# EAGLE design Auction_Single_RevB_Final (EAGLE 7.4.0)
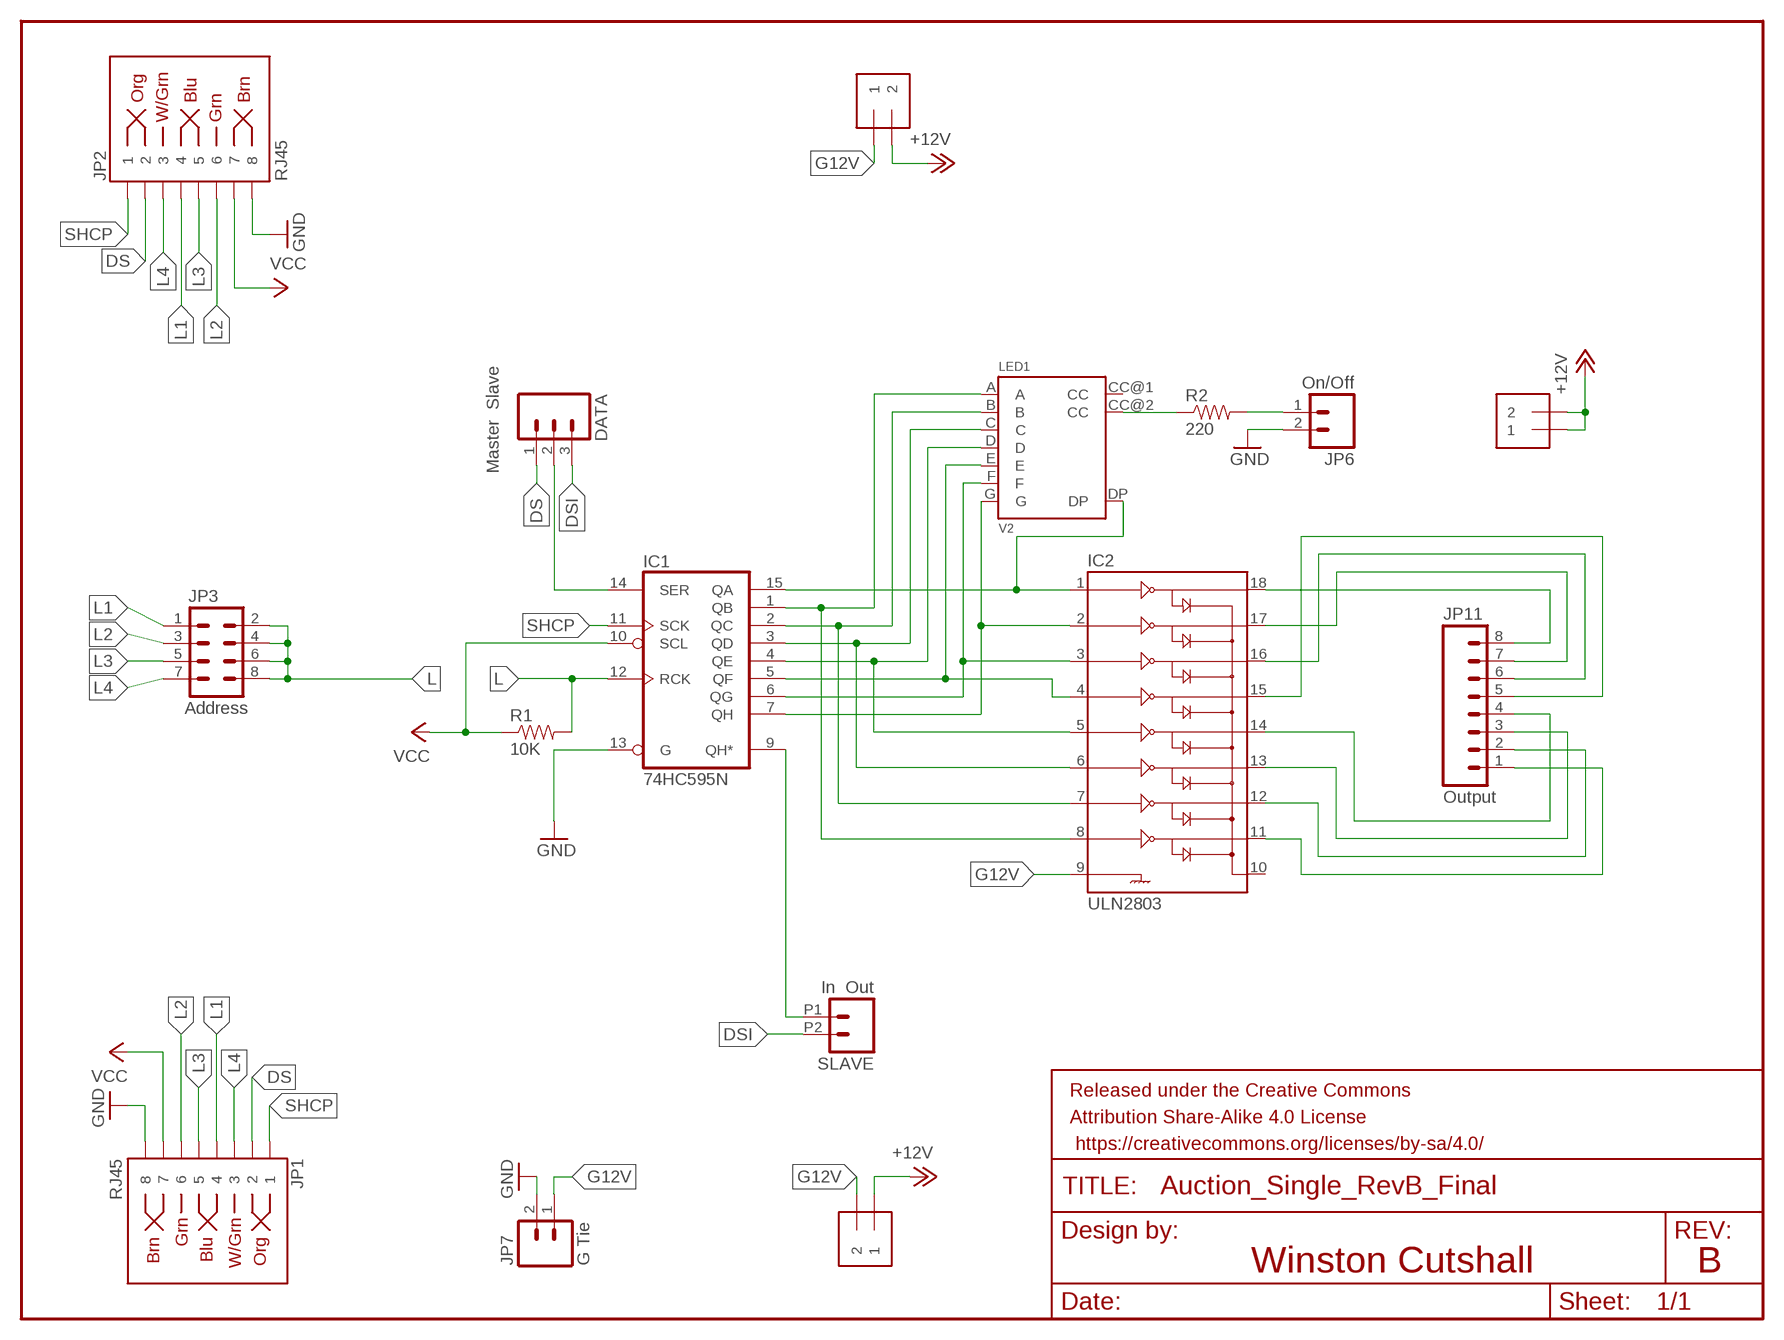
[diagram p0: schematic, sheet 1]

## Parts
DATA  Master Slave  M03PTH  [1X03]
FRAME1  FRAME-LETTER  [CREATIVE_COMMONS]
IC1  74HC595N  [DIL16]
IC2  ULN2803  ULN2803DIP  [DIL18]
JP1  RJ45  RJ45-8PTH  [RJ45-8]
JP2  RJ45  RJ45-8PTH  [RJ45-8]
JP3  Address  M04X2  [2X4]
JP6  On/Off  M02PTH  [1X02]
JP7  G Tie  M02PTH  [1X02]
JP8  1X2-3.5MM  [1X2-3.5MM]
JP9  1X2-3.5MM  [1X2-3.5MM]
JP10  1X2-3.5MM  [1X2-3.5MM]
JP11  Output  M083.5MM-8  [SCREWTERMINAL-3.5MM-8]
LED1  V2  HDSP-C3X3  [HDSP-C3X3]
R1  10K  RESISTOREZ  [AXIAL-0.3EZ]
R2  220  RESISTOREZ  [AXIAL-0.3EZ]
SLAVE  In Out  M022.54MM_SCREWTERM  [1X02_2.54_SCREWTERM]

## Nets
+12V [High Current]: JP8.1 JP9.2 JP10.1 JP10.2
A: IC1.1(QB) IC2.8 LED1.A
AA [High Current]: IC2.11 JP11.1
B: IC1.2(QC) IC2.7 LED1.B
BB [High Current]: IC2.12 JP11.2
C: IC1.3(QD) IC2.6 LED1.C
CC [High Current]: IC2.13 JP11.3
D: IC1.4(QE) IC2.5 LED1.D
DD [High Current]: IC2.14 JP11.4
DIP_SEG [Power]: JP6.1 R2.P$2
DP: IC1.15(QA) IC2.1 LED1.DP
DPA [High Current]: IC2.18 JP11.8
DS: DATA.1 JP1.2 JP2.2
DSF: DATA.2 IC1.14(SER)
DSI: DATA.3 SLAVE.P2
E: IC1.5(QF) IC2.4 LED1.E
EE [High Current]: IC2.15 JP11.5
F: IC1.6(QG) IC2.3 LED1.F
FF [High Current]: IC2.16 JP11.6
G: IC1.7(QH) IC2.2 LED1.G
G12V [High Current]: IC2.9 JP7.1 JP8.2 JP9.1
GG [High Current]: IC2.17 JP11.7
GND [Power]: IC1.13(G) JP1.8 JP2.8 JP6.2 JP7.2
L: IC1.12(RCK) JP3.2 JP3.4 JP3.6 JP3.8 R1.P$2
L1: JP1.4 JP2.4 JP3.1
L2: JP1.6 JP2.6 JP3.3
L3: JP1.5 JP2.5 JP3.5
L4: JP1.3 JP2.3 JP3.7
N$2 [Power]: LED1.CC@2(CC) R2.P$1
N$17: IC1.9(QH*) SLAVE.P1
SHCP: IC1.11(SCK) JP1.1 JP2.1
VCC [Power]: IC1.10(SCL) JP1.7 JP2.7 R1.P$1
Unconnected: IC2.10 LED1.CC@1(CC)

## Notes on the sheet
- Winston Cutshall | B

## Power pins joined to a net without a drawn wire
GND: IC1.8(GND)
VCC: IC1.16(VCC)

## Library data of the parts
DATA = SparkFun-Connectors:M03: Header 3 Standard 3-pin 0.1" header. Use with straight break away headers (SKU : PRT-00116), right angle break away headers (PRT-00553), swiss pins (PRT-00743), machine pins (PRT-00117), and female headers (PRT-00115). Molex polarized connector foot print use with SKU : PRT-08232 with associated crimp pins and housings.; MPN: 2211S-03G; OC_NEWARK: 08N6745
FRAME1 = SparkFun-Aesthetics:FRAME-LETTER: Schematic Frame Standard 8.5x11 US Letter frame
IC1 = 74xx-eu:74*595: 8-bit SHIFT REGISTER, output latch; MF: TEXAS INSTRUMENTS; MPN: SN74HC595N; OC_NEWARK: 60K6845
IC2 = SparkFun-PowerIC:ULN2803: Darlington Driver ULN2803 Darlington array. 500mA max per channel, 8-channel package. Spark Fun Electronics SKU : COM-00312; MF: Arrow Electronics; MPN: ULN2803A; OC_NEWARK: 89K1143
JP1 JP2 = SparkFun-Connectors:RJ45-8: RJ45 Jack Simple RJ45, 8-pin connection - connector for common Cat5, Cat5e, and Cat6 Ethernet cables. Footprint not yet proven in production. Connector sku is PRT-00643; Breakout PCB sku is BOB-00716.; MPN: 54602-908LF; OC_NEWARK: 51M7962; PROD_ID: CONN-08506
JP3 = SparkFun-Connectors:M04X2: .1" header, two rows of four.; MPN: M20-9980446; OC_NEWARK: 56K0011
JP6 JP7 = SparkFun-Connectors:M02: Standard 2-pin 0.1" header. Use with - straight break away headers ( PRT-00116) - right angle break away headers (PRT-00553) - swiss pins (PRT-00743) - machine pins (PRT-00117) - female headers (PRT-00115) Molex polarized connector foot print use with: PRT-08233 with associated crimp pins and housings. 2.54_SCREWTERM for use with PRT-10571. 3.5mm Screw Terminal footprints for PRT-08084 5mm Screw Terminal footprints for use with PRT-08432; MPN: 2211S-02G; OC_NEWARK: 08N6744
JP8-JP10 = adafruit:1X2: 3.5mm Terminal block http://www.ladyada.net/library/pcb/eaglelibrary.html; MPN: 1776275-2; OC_NEWARK: 97M9695
JP11 = SparkFun-Connectors:M08: Header 8 Standard 8-pin 0.1" header. Use with straight break away headers (SKU : PRT-00116), right angle break away headers (PRT-00553), swiss pins (PRT-00743), machine pins (PRT-00117), and female headers (PRT-00115).; MPN: 20020327-C081B01LF; OC_NEWARK: 59R8949
LED1 = Winston:HDSP-C3X3: Single Digit Seven Segment Display HDSP-C3x3 0.36” Single Digit PCB Based LED Display Avago Technologies www.avagotech.com (WC Lib)
R1 = SparkFun-Passives:RESISTOR: Resistor Basic schematic elements and footprints for 0603, 1206, and PTH resistors.; MF: FARNELL; MPN: MCF 0.25W 10K; OC_NEWARK: 38K0328
R2 = SparkFun-Passives:RESISTOR: Resistor Basic schematic elements and footprints for 0603, 1206, and PTH resistors.; MF: FARNELL; MPN: MCF 0.25W 220R; OC_NEWARK: 38K0351
SLAVE = SparkFun-Connectors:M02: Standard 2-pin 0.1" header. Use with - straight break away headers ( PRT-00116) - right angle break away headers (PRT-00553) - swiss pins (PRT-00743) - machine pins (PRT-00117) - female headers (PRT-00115) Molex polarized connector foot print use with: PRT-08233 with associated crimp pins and housings. 2.54_SCREWTERM for use with PRT-10571. 3.5mm Screw Terminal footprints for PRT-08084 5mm Screw Terminal footprints for use with PRT-08432; MF: TYCO ELECTRONICS; MPN: 282834-2; OC_NEWARK: 12H8386

## Net classes
0 Signal: width 0.305 mm, drill 0.635 mm, clearance 0.305 mm
1 Power: width 0.508 mm, drill 0.508 mm, clearance 0.508 mm
2 High Current: width 1.016 mm, drill 1.016 mm, clearance 1.016 mm

## Board
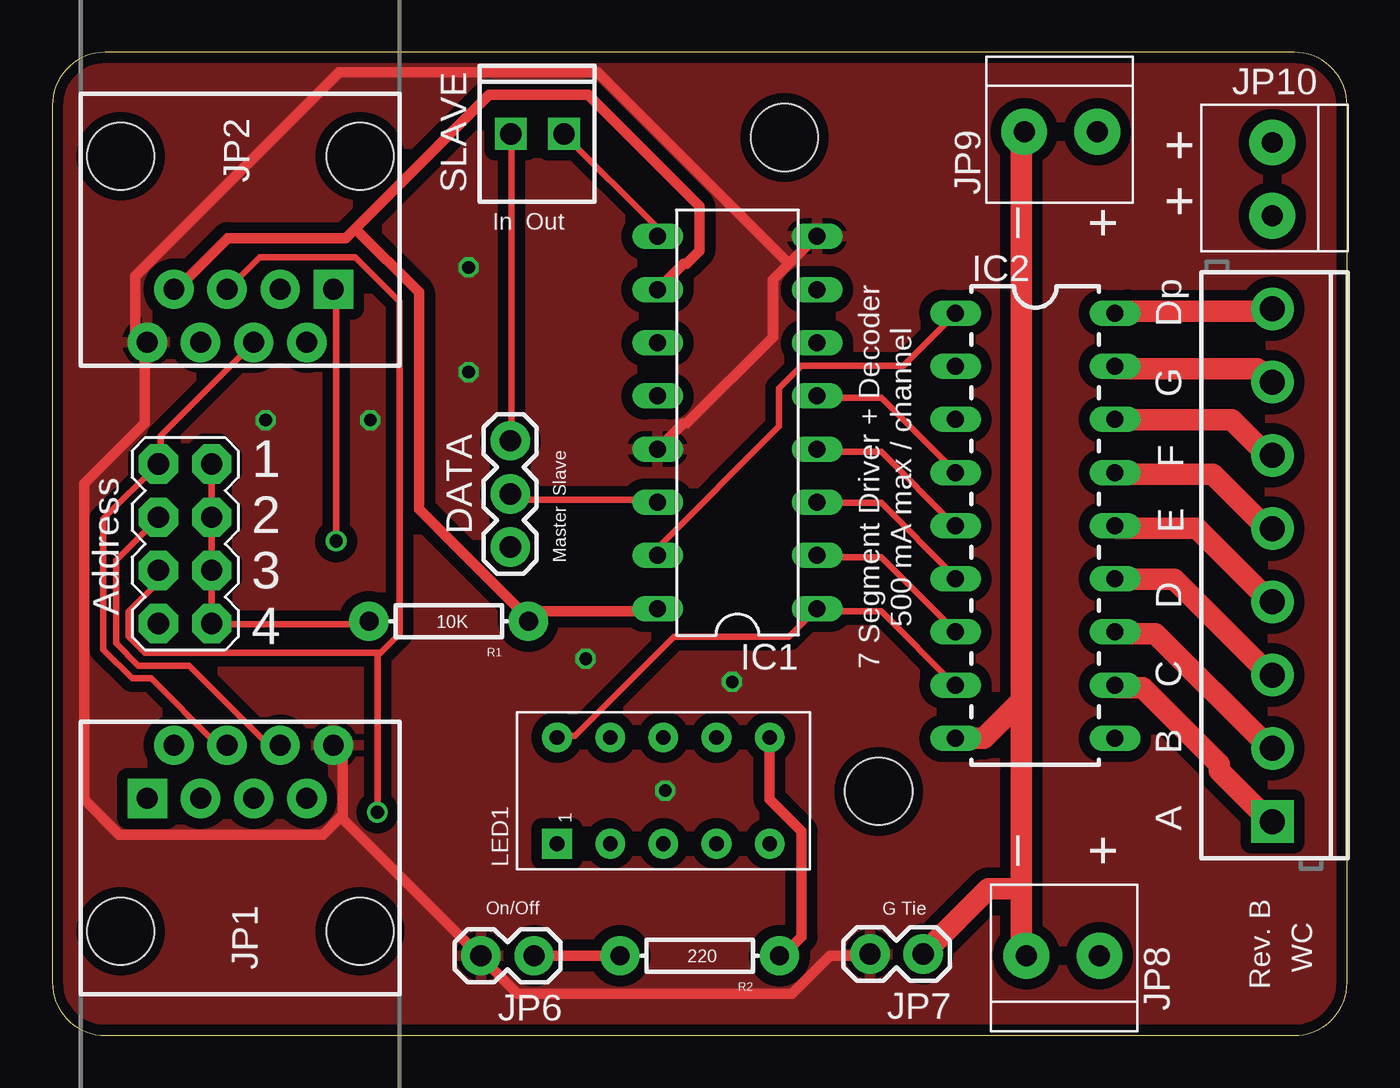
[diagram p1: board, top side]
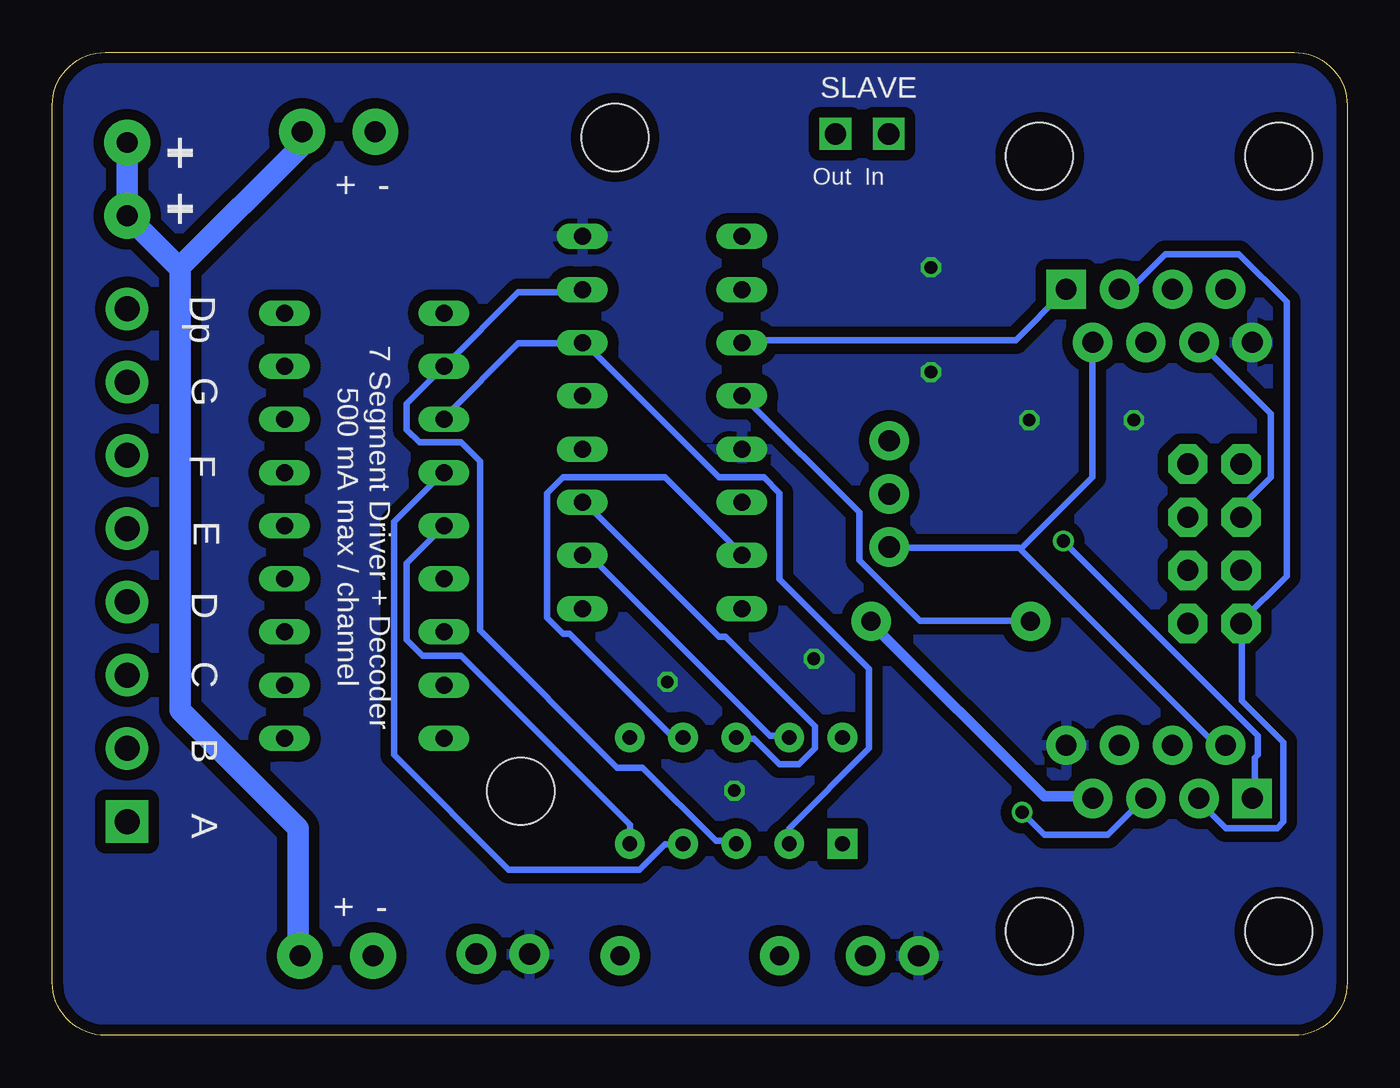
[diagram p2: board, bottom side, seen from below]

Size 61.9 x 46.98 mm. Coordinates in mm from the lower left corner, seen from the top.
Outline: 0,44.44 0,2.54 arc90 2.54,0 59.36,0 arc90 61.9,2.54 61.9,44.44 arc90 59.36,46.98 2.54,46.98 arc90 0,44.44
Copper layers (1*16): Top 0.0356mm / dielectric 1.5011mm / Bottom 0.0356mm
Design rules "LaenPCBOrder": minimum track width 6mil, minimum drill 13mil, track to track 6mil, track to pad 6mil, pad to pad 6mil, via to via 6mil, smd to smd 6mil, copper to edge 15mil, drill to drill 6mil, minimum pad ring 7mil, minimum via ring 7mil, stop-mask expansion 3mil, vias tented up to drill 0mil, thermal gap 10mil
Holes 3.2 mm at 35.01,42.91 39.51,11.66

### Footprints (pad centres in the part's own frame; a part is rotated, then mirrored left to right if it is on the bottom)
1X03 = drill 1.016 pad 1.88: 1 0,0; 2 2.54,0; 3 5.08,0
DIL16 = drill 0.813 long: 1 -8.89,-3.81; 2 -6.35,-3.81; 3 -3.81,-3.81; 4 -1.27,-3.81; 5 1.27,-3.81; 6 3.81,-3.81; 7 6.35,-3.81; 8 8.89,-3.81; 9 8.89,3.81; 10 6.35,3.81; 11 3.81,3.81; 12 1.27,3.81; 13 -1.27,3.81; 14 -3.81,3.81; 15 -6.35,3.81; 16 -8.89,3.81
DIL18 = drill 0.813 long: 1 -10.16,-3.81; 2 -7.62,-3.81; 3 -5.08,-3.81; 4 -2.54,-3.81; 5 0,-3.81; 6 2.54,-3.81; 7 5.08,-3.81; 8 7.62,-3.81; 9 10.16,-3.81; 10 10.16,3.81; 11 7.62,3.81; 12 5.08,3.81; 13 2.54,3.81; 14 0,3.81; 15 -2.54,3.81; 16 -5.08,3.81; 17 -7.62,3.81; 18 -10.16,3.81
RJ45-8 = drill 1 pad 1.88 square: 1 -4.445,6.35 | drill 1 pad 1.88: 2 -3.175,8.89; 3 -1.905,6.35; 4 -0.635,8.89; 5 0.635,6.35; 6 1.905,8.89; 7 3.175,6.35; 8 4.445,8.89 | hole 3.2: -5.715,0; 5.715,0
2X4 = drill 1.016 pad 1.88 octagon: 1 -3.81,-1.27; 2 -3.81,1.27; 3 -1.27,-1.27; 4 -1.27,1.27; 5 1.27,-1.27; 6 1.27,1.27; 7 3.81,-1.27; 8 3.81,1.27
1X02 = drill 1.016 pad 1.88: 1 0,0; 2 2.54,0
1X2-3.5MM = drill 1 pad 2.184: 1 1.8,0; 2 -1.7,0
SCREWTERMINAL-3.5MM-8 = drill 1.2 pad 2.032 square: 1 0,0 | drill 1.2 pad 2.032: 2 3.5,0; 3 7,0; 4 10.5,0; 5 14,0; 6 17.5,0; 7 21,0; 8 24.5,0
HDSP-C3X3 = drill 0.7 pad 1.422: A 2.54,5.08; B 2.54,2.54; C 2.54,0; CC@2 2.54,-5.08; D -2.54,-5.08; DP 2.54,-2.54; E -2.54,-2.54; F -2.54,2.54; G -2.54,0 | drill 0.7 pad 1.422 square: CC@1 -2.54,5.08
AXIAL-0.3EZ = drill 0.9 pad 1.88: P$1 -3.81,0; P$2 3.81,0
1X02_2.54_SCREWTERM = drill 1.016 square: P1 2.54,0; P2 0,0

### Placement (x,y rotation side)
DATA  21.89,23.34 90 top
FRAME1  15,-20 0 top  (outside the outline)
IC1  32.75,29.29 90 top
IC2  46.99,24.36 270 top
JP1  8.99,4.98 0 top
JP2  8.99,42.01 180 top
JP3  6.35,23.5 270 top
JP6  23.03,3.81 180 top
JP7  41.63,3.89 180 top
JP8  48.26,3.81 0 top
JP9  48.26,43.18 180 top
JP10  58.32,40.87 90 top
JP11  58.32,10.22 90 top
LED1  29.21,11.7 90 top
R1  18.95,19.79 180 top
R2  30.95,3.81 180 top
SLAVE  21.92,43.08 0 top

### Tracks (layer width: path | path; a pad name or v marks a point on that pad's centre or on a via)
+12V
  Bottom 1.016: 55.78,36.73 55.78,15.54 50.14,9.91 50.14,3.81 JP8.1 | JP9.2 49.96,42.55 55.78,36.73 | 55.78,36.73 55.88,36.73 JP10.2 JP10.1
A
  Top 0.305: IC2.8 43.13,16.76 39.62,20.27 36.58,20.27 IC1.1 36.42,20.27 35.2,19.05 29.72,19.05 24.99,14.33 24.23,14.33 LED1.A
AA
  Top 1.016: IC2.11 50.9,16.61 52.12,16.61 55.78,12.95 55.78,12.65 58.22,10.21 JP11.1
B
  Top 0.305: IC1.2 36.58,22.86 39.62,22.86 43.13,19.36 IC2.7
  Bottom 0.305: LED1.B 26.67,14.33 27.58,14.33 36.12,22.86 36.42,22.86 IC1.2
BB
  Top 1.016: IC2.12 50.9,19.2 52.73,19.2 58.22,13.72 JP11.2
C
  Top 0.305: IC1.3 36.58,25.45 39.62,25.45 43.13,21.95 IC2.6
  Bottom 0.305: LED1.C 29.11,14.17 28.35,14.17 27.13,12.95 26.21,12.95 25.45,13.72 25.45,14.78 29.72,19.05 30.02,19.05 36.42,25.45 IC1.3
CC
  Top 1.016: IC2.13 50.9,21.79 53.65,21.79 58.22,17.22 JP11.3
D
  Top 0.305: IC1.4 36.58,27.89 39.62,27.89 43.13,24.38 IC2.5
  Bottom 0.305: LED1.D 34.29,10.06 42.37,18.14 44.2,18.14 44.96,18.9 44.96,22.55 43.28,24.23 IC2.5
DD
  Top 1.016: IC2.14 50.9,24.23 54.71,24.23 58.22,20.73 JP11.4
DIP_SEG
  Top 0.508: R2.P$2 JP6.1
DP
  Top 0.305: IC1.15 28.96,23.01 28.96,23.32 34.75,29.11 34.75,30.94 35.81,32 40.69,32 43.13,34.44 IC2.1
  Bottom 0.305: LED1.DP 31.85,14.33 32.31,14.33 37.19,19.2 37.49,19.2 38.25,19.96 38.25,25.91 37.49,26.67 32.61,26.67 28.96,23.01 IC1.15
DPA
  Top 1.016: IC2.18 50.9,34.59 58.22,34.59 JP11.8
DS
  Bottom 0.305: 15.62,23.24 15.7,23.32 21.79,23.32 DATA.1 | 15.62,23.24 6.4,14.02 5.94,14.02 JP1.2 | 15.62,23.24 12.19,26.67 12.19,33.07 JP2.2
DSF
  Top 0.305: IC1.14 28.8,25.6 22.1,25.6 21.95,25.76 DATA.2
DSI
  Top 0.305: SLAVE.P2 21.95,42.98 21.95,28.5 DATA.3
E
  Top 0.305: IC1.5 36.58,30.48 39.62,30.48 43.13,26.98 IC2.4
  Bottom 0.305: LED1.E 31.85,9.14 32.61,9.14 33.83,7.92 40.08,7.92 45.57,13.41 45.57,24.54 43.28,26.82 IC2.4
EE
  Top 1.016: IC2.15 50.9,26.82 55.47,26.82 58.22,24.08 JP11.5
F
  Bottom 0.305: IC2.3 43.13,29.57 39.62,33.07 36.58,33.07 IC1.6 36.42,33.07 30.02,26.67 27.89,26.67 27.13,25.91 27.13,21.79 22.86,17.53 22.86,13.72 26.67,9.91 LED1.F
FF
  Top 1.016: IC2.16 50.9,29.41 56.39,29.41 58.22,27.58 JP11.6
G
  Bottom 0.305: IC1.7 36.58,35.51 39.62,35.51 43.13,32 IC2.2 43.28,31.85 44.96,30.18 44.96,28.96 44.35,28.35 42.37,28.35 41.45,27.43 41.45,19.36 34.9,12.8 33.68,12.8 30.18,9.3 29.26,9.3 LED1.G
G12V
  Top 1.016: 46.33,7 46.33,4.04 JP8.2 | 46.33,7 46.33,16 | 46.33,16 46.33,43.13 JP9.1 | IC2.9 44.53,14.2 46.33,16 | JP7.1 44.74,7 46.33,7
GG
  Top 1.016: IC2.17 50.9,31.85 57.61,31.85 58.22,31.24 JP11.7
GND  (via drill 0.6)
  Top 0.508: 35.2,36.88 36.42,38.1 IC1.8 | 35.2,36.88 34.44,36.12 34.44,33.38 30.33,29.26 30.18,29.26 28.96,28.04 IC1.13 | 13.79,10.44 13.87,10.52 13.87,13.56 13.56,13.87 JP1.8 | 13.79,10.44 12.95,9.6 3.2,9.6 1.52,11.28 1.52,26.36 4.42,29.26 4.42,33.07 JP2.8 4.27,33.22 3.96,33.53 3.96,36.27 13.72,46.02 26.06,46.02 35.2,36.88 | 13.79,10.44 20.42,3.81 JP6.2 20.57,3.66 22.25,1.98 35.36,1.98 37.19,3.81 39.01,3.81 JP7.2
  other vias: 19.9,36.7 19.9,31.7 15.2,29.4 10.2,29.4 29.3,11.7 25.5,18 32.5,16.9
  pour Bottom (isolate 0.508): -10,60 70,60 70,-10 -10,-10
  pour Top (isolate 0.508): -5,55 65,55 65,-5 -5,-5
L
  Top 0.305: JP3.2 JP3.4 JP3.6 JP3.8 7.62,19.66 15.09,19.66 R1.P$2
  Bottom 0.305: IC1.12 28.8,30.48 23.32,24.99 23.32,22.71 20.42,19.81 15.24,19.81 R1.P$2
L1
  Top 0.305: JP2.4 9.6,33.07 5.18,28.65 5.18,27.43 JP3.1 5.03,27.28 2.44,24.69 2.44,18.44 3.81,17.07 4.72,17.07 7.77,14.02 8.23,14.02 JP1.4
L2
  Top 0.305: JP1.6 10.82,14.02 10.21,14.02 6.55,17.68 4.12,17.68 3.05,18.75 3.05,22.71 5.03,24.69 JP3.3
  Bottom 0.305: JP3.3 5.03,24.84 5.03,25.3 3.66,26.67 3.66,29.72 7.01,33.07 JP2.6
L3  (via drill 0.64)
  Top 0.305: 15.54,18.29 15.7,18.29 16.61,19.2 16.61,35.05 14.48,37.19 9.91,37.19 8.38,35.66 JP2.5 | 15.54,18.29 4.42,18.29 3.66,19.05 3.66,20.27 5.03,21.64 5.03,22.1 JP3.5 | 15.54,18.29 v15.54,10.67
  Bottom 0.305: v15.54,10.67 14.48,9.6 11.43,9.6 9.75,11.28 JP1.5
L4
  Bottom 0.305: JP1.3 7.16,11.28 5.79,9.91 3.35,9.91 3.05,10.21 3.05,14.02 5.03,16 5.03,19.66 JP3.7 5.03,19.81 2.9,21.95 2.9,35.05 5.18,37.34 8.69,37.34 10.36,35.66 10.82,35.66 JP2.3
N$2
  Top 0.508: LED1.CC@2 34.29,11.28 35.81,9.75 35.81,4.72 34.9,3.81 R2.P$1
N$17
  Top 0.305: IC1.9 28.8,38.25 28.8,38.71 24.54,42.98 SLAVE.P1
SHCP  (via drill 0.64)
  Top 0.305: v13.56,23.62 13.56,35.51 JP2.1
  Bottom 0.305: IC1.11 28.8,33.22 15.85,33.22 13.56,35.51 JP2.1 | v13.56,23.62 4.27,14.33 4.27,13.41 4.42,13.26 4.42,11.43 JP1.1
VCC
  Top 0.508: IC1.16 28.8,20.27 23.32,20.27 22.86,19.81 R1.P$1 22.71,19.96 17.53,25.15 17.53,35.51 14.48,38.56 | 14.48,38.56 14.02,38.1 8.38,38.1 5.94,35.66 JP2.7 | 14.48,38.56 20.88,44.96 25.6,44.96 30.94,39.62 30.94,37.49 30.33,36.88 30.18,36.88 28.96,35.66 IC1.10
  Bottom 0.508: JP1.7 12.19,11.43 14.48,11.43 22.71,19.66 R1.P$1

### Text on the board
tNames: _ / / + | + / + | Dp | G | F | 7 Segment Driver + Decoder / 500 mA max / channel | E | D | 1 / 2 / 3 / 4 | C | B | A | _ / / + | Rev. B | WC
bNames: SLAVE | Out In | + - | + / + | + / + | Dp | G | F | E | 7 Segment Driver + Decoder / 500 mA max / channel | D | C | B | A | + -